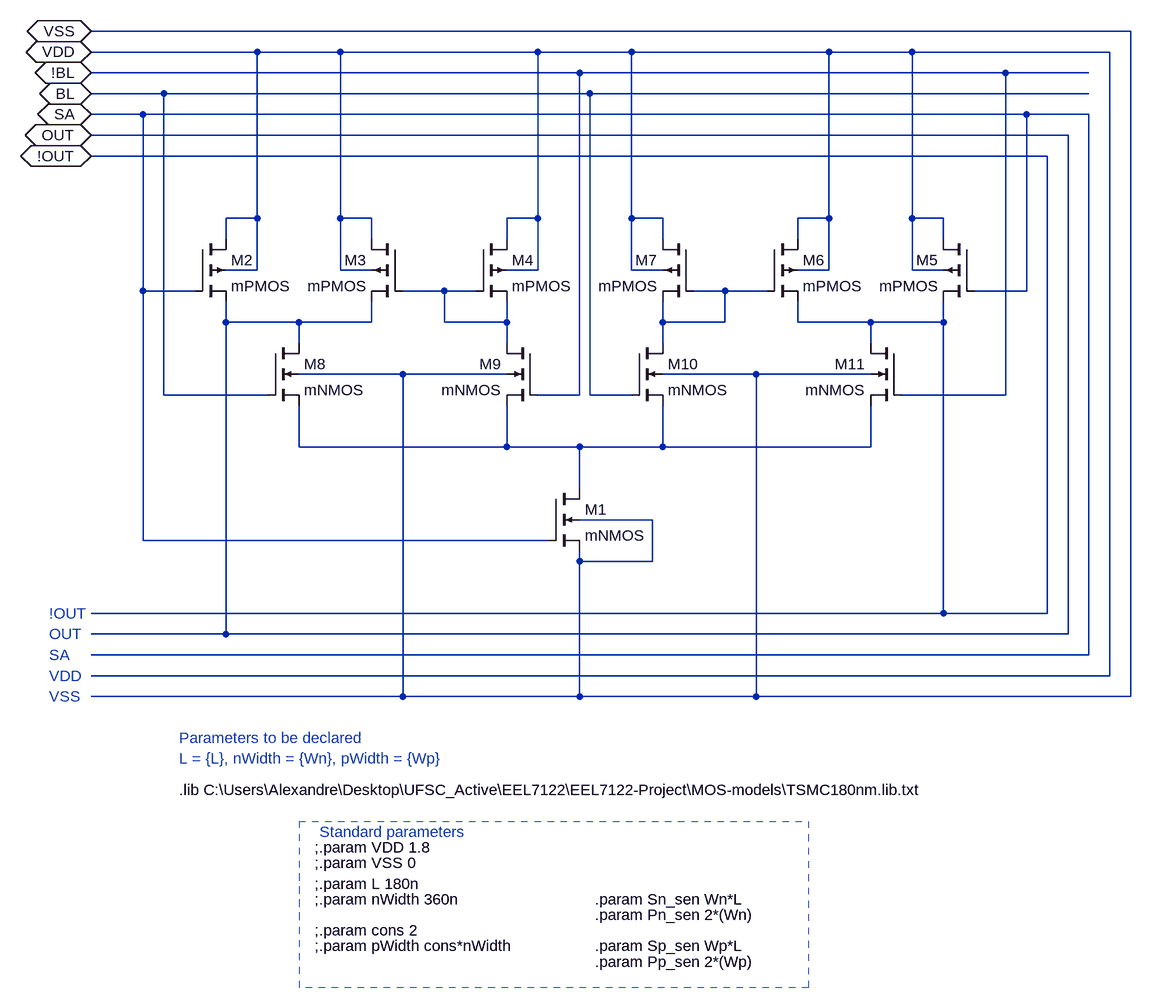
[diagram p0: schematic SEN_AMP_2.asc]
SEN_AMP_2.asc, the LTspice schematic file:
Version 4
SHEET 1 996 964
WIRE 896 -512 -704 -512
WIRE -448 -480 -704 -480
WIRE -320 -480 -448 -480
WIRE -16 -480 -320 -480
WIRE 128 -480 -16 -480
WIRE 432 -480 128 -480
WIRE 560 -480 432 -480
WIRE 864 -480 560 -480
WIRE 48 -448 -704 -448
WIRE 704 -448 48 -448
WIRE 832 -448 704 -448
WIRE -592 -416 -704 -416
WIRE 64 -416 -592 -416
WIRE 832 -416 64 -416
WIRE -624 -384 -704 -384
WIRE 736 -384 -624 -384
WIRE 832 -384 736 -384
WIRE 800 -352 -704 -352
WIRE 768 -320 -704 -320
WIRE -448 -224 -448 -480
WIRE -448 -224 -496 -224
WIRE -320 -224 -320 -480
WIRE -272 -224 -320 -224
WIRE -16 -224 -16 -480
WIRE -16 -224 -64 -224
WIRE 128 -224 128 -480
WIRE 176 -224 128 -224
WIRE 432 -224 432 -480
WIRE 432 -224 384 -224
WIRE 560 -224 560 -480
WIRE 608 -224 560 -224
WIRE -496 -192 -496 -224
WIRE -272 -192 -272 -224
WIRE -64 -192 -64 -224
WIRE 176 -192 176 -224
WIRE 384 -192 384 -224
WIRE 608 -192 608 -224
WIRE -448 -144 -448 -224
WIRE -448 -144 -496 -144
WIRE -320 -144 -320 -224
WIRE -272 -144 -320 -144
WIRE -16 -144 -16 -224
WIRE -16 -144 -64 -144
WIRE 128 -144 128 -224
WIRE 176 -144 128 -144
WIRE 432 -144 432 -224
WIRE 432 -144 384 -144
WIRE 560 -144 560 -224
WIRE 608 -144 560 -144
WIRE -624 -112 -624 -384
WIRE -544 -112 -624 -112
WIRE -160 -112 -224 -112
WIRE -112 -112 -160 -112
WIRE 272 -112 224 -112
WIRE 336 -112 272 -112
WIRE 736 -112 736 -384
WIRE 736 -112 656 -112
WIRE -496 -64 -496 -96
WIRE -384 -64 -496 -64
WIRE -272 -64 -272 -96
WIRE -272 -64 -384 -64
WIRE -160 -64 -160 -112
WIRE -64 -64 -64 -96
WIRE -64 -64 -160 -64
WIRE 176 -64 176 -96
WIRE 272 -64 272 -112
WIRE 272 -64 176 -64
WIRE 384 -64 384 -96
WIRE 496 -64 384 -64
WIRE 608 -64 608 -96
WIRE 608 -64 496 -64
WIRE -384 -32 -384 -64
WIRE -64 -32 -64 -64
WIRE 176 -32 176 -64
WIRE 496 -32 496 -64
WIRE -224 16 -384 16
WIRE -64 16 -224 16
WIRE 320 16 176 16
WIRE 496 16 320 16
WIRE -592 48 -592 -416
WIRE -432 48 -592 48
WIRE 48 48 48 -448
WIRE 48 48 -16 48
WIRE 64 48 64 -416
WIRE 128 48 64 48
WIRE 704 48 704 -448
WIRE 704 48 544 48
WIRE -384 128 -384 64
WIRE -64 128 -64 64
WIRE -64 128 -384 128
WIRE 48 128 -64 128
WIRE 176 128 176 64
WIRE 176 128 48 128
WIRE 496 128 496 64
WIRE 496 128 176 128
WIRE 48 192 48 128
WIRE 160 240 48 240
WIRE -624 272 -624 -112
WIRE 0 272 -624 272
WIRE 48 304 48 288
WIRE 160 304 160 240
WIRE 160 304 48 304
WIRE 608 384 608 -64
WIRE 608 384 -704 384
WIRE 768 384 768 -320
WIRE 768 384 608 384
WIRE -496 416 -496 -64
WIRE -496 416 -704 416
WIRE 800 416 800 -352
WIRE 800 416 -496 416
WIRE 832 448 832 -384
WIRE 832 448 -704 448
WIRE 864 480 864 -480
WIRE 864 480 -704 480
WIRE -224 512 -224 16
WIRE -224 512 -704 512
WIRE 48 512 48 304
WIRE 48 512 -224 512
WIRE 320 512 320 16
WIRE 320 512 48 512
WIRE 896 512 896 -512
WIRE 896 512 320 512
FLAG -704 -512 VSS
IOPIN -704 -512 BiDir
FLAG -704 -480 VDD
IOPIN -704 -480 BiDir
FLAG -704 -448 !BL
IOPIN -704 -448 BiDir
FLAG -704 -416 BL
IOPIN -704 -416 BiDir
FLAG -704 -384 SA
IOPIN -704 -384 BiDir
FLAG -704 -352 OUT
IOPIN -704 -352 BiDir
FLAG -704 -320 !OUT
IOPIN -704 -320 BiDir
SYMBOL nmos4 0 192 R0
SYMATTR InstName M1
SYMATTR Value mNMOS
SYMATTR Value2 l={L} w={nWidth} ad={Sn_sen} as={Sn_sen} pd={Pn_sen} ps={Pn_sen} m=1
SYMBOL pmos4 -544 -192 R0
SYMATTR InstName M2
SYMATTR Value mPMOS
SYMATTR Value2 l=180n w={pWidth} ad={Sp_sen} as={Sp_sen} pd={Pp_sen} ps={Pp_sen} m=1
SYMBOL pmos4 -224 -192 M0
SYMATTR InstName M3
SYMATTR Value mPMOS
SYMATTR Value2 l=180n w={pWidth} ad={Sp_sen} as={Sp_sen} pd={Pp_sen} ps={Pp_sen} m=1
SYMBOL pmos4 -112 -192 R0
SYMATTR InstName M4
SYMATTR Value mPMOS
SYMATTR Value2 l=180n w={pWidth} ad={Sp_sen} as={Sp_sen} pd={Pp_sen} ps={Pp_sen} m=1
SYMBOL pmos4 656 -192 M0
SYMATTR InstName M5
SYMATTR Value mPMOS
SYMATTR Value2 l=180n w={pWidth} ad={Sp_sen} as={Sp_sen} pd={Pp_sen} ps={Pp_sen} m=1
SYMBOL pmos4 336 -192 R0
SYMATTR InstName M6
SYMATTR Value mPMOS
SYMATTR Value2 l=180n w={pWidth} ad={Sp_sen} as={Sp_sen} pd={Pp_sen} ps={Pp_sen} m=1
SYMBOL pmos4 224 -192 M0
SYMATTR InstName M7
SYMATTR Value mPMOS
SYMATTR Value2 l=180n w={pWidth} ad={Sp_sen} as={Sp_sen} pd={Pp_sen} ps={Pp_sen} m=1
SYMBOL nmos4 -432 -32 R0
SYMATTR InstName M8
SYMATTR Value mNMOS
SYMATTR Value2 l={L} w={nWidth} ad={Sn_sen} as={Sn_sen} pd={Pn_sen} ps={Pn_sen} m=1
SYMBOL nmos4 -16 -32 M0
SYMATTR InstName M9
SYMATTR Value mNMOS
SYMATTR Value2 l={L} w={nWidth} ad={Sn_sen} as={Sn_sen} pd={Pn_sen} ps={Pn_sen} m=1
SYMBOL nmos4 128 -32 R0
SYMATTR InstName M10
SYMATTR Value mNMOS
SYMATTR Value2 l={L} w={nWidth} ad={Sn_sen} as={Sn_sen} pd={Pn_sen} ps={Pn_sen} m=1
SYMBOL nmos4 544 -32 M0
SYMATTR InstName M11
SYMATTR Value mNMOS
SYMATTR Value2 l={L} w={nWidth} ad={Sn_sen} as={Sn_sen} pd={Pn_sen} ps={Pn_sen} m=1
TEXT -568 656 Left 2 !.lib C:\\Users\\Alexandre\\Desktop\\UFSC_Active\\EEL7122\\EEL7122-Project\\MOS-models\\TSMC180nm.lib.txt
TEXT -352 720 Left 2 ;Standard parameters
TEXT -360 744 Left 2 !;.param VDD 1.8
TEXT -360 768 Left 2 !;.param VSS 0
TEXT -360 824 Left 2 !;.param nWidth 360n
TEXT -360 896 Left 2 !;.param pWidth cons*nWidth
TEXT 72 896 Left 2 !.param Sp_sen Wp*L
TEXT 72 920 Left 2 !.param Pp_sen 2*(Wp)
TEXT 72 824 Left 2 !.param Sn_sen Wn*L
TEXT 72 848 Left 2 !.param Pn_sen 2*(Wn)
TEXT -360 872 Left 2 !;.param cons 2
TEXT -360 800 Left 2 !;.param L 180n
TEXT -568 576 Left 2 ;Parameters to be declared\nL = {L}, nWidth = {Wn}, pWidth = {Wp}
TEXT -768 416 Left 2 ;OUT
TEXT -768 384 Left 2 ;!OUT
TEXT -768 448 Left 2 ;SA
TEXT -768 480 Left 2 ;VDD
TEXT -768 512 Left 2 ;VSS
LINE Normal -384 704 240 704 2
LINE Normal -384 704 -384 928 2
LINE Normal -384 928 -384 960 2
LINE Normal -384 784 -384 864 2
LINE Normal 400 960 -384 960 2
LINE Normal 400 704 400 960 2
LINE Normal 240 704 400 704 2

The netlist it stands for:
* SEN_AMP_2.asc
M1 N003 SA VSS VSS mNMOS l={L} w={nWidth} ad={Sn_sen} as={Sn_sen} pd={Pn_sen} ps={Pn_sen} m=1
M2 VDD SA OUT VDD mPMOS l=180n w={pWidth} ad={Sp_sen} as={Sp_sen} pd={Pp_sen} ps={Pp_sen} m=1
M3 VDD N001 OUT VDD mPMOS l=180n w={pWidth} ad={Sp_sen} as={Sp_sen} pd={Pp_sen} ps={Pp_sen} m=1
M4 VDD N001 N001 VDD mPMOS l=180n w={pWidth} ad={Sp_sen} as={Sp_sen} pd={Pp_sen} ps={Pp_sen} m=1
M5 VDD SA !OUT VDD mPMOS l=180n w={pWidth} ad={Sp_sen} as={Sp_sen} pd={Pp_sen} ps={Pp_sen} m=1
M6 VDD N002 !OUT VDD mPMOS l=180n w={pWidth} ad={Sp_sen} as={Sp_sen} pd={Pp_sen} ps={Pp_sen} m=1
M7 VDD N002 N002 VDD mPMOS l=180n w={pWidth} ad={Sp_sen} as={Sp_sen} pd={Pp_sen} ps={Pp_sen} m=1
M8 OUT BL N003 VSS mNMOS l={L} w={nWidth} ad={Sn_sen} as={Sn_sen} pd={Pn_sen} ps={Pn_sen} m=1
M9 N001 !BL N003 VSS mNMOS l={L} w={nWidth} ad={Sn_sen} as={Sn_sen} pd={Pn_sen} ps={Pn_sen} m=1
M10 N002 BL N003 VSS mNMOS l={L} w={nWidth} ad={Sn_sen} as={Sn_sen} pd={Pn_sen} ps={Pn_sen} m=1
M11 !OUT !BL N003 VSS mNMOS l={L} w={nWidth} ad={Sn_sen} as={Sn_sen} pd={Pn_sen} ps={Pn_sen} m=1
.model NMOS NMOS
.model PMOS PMOS
.lib standard.mos
.lib C:\Users\Alexandre\Desktop\UFSC_Active\EEL7122\EEL7122-Project\MOS-models\TSMC180nm.lib.txt
* Standard parameters
;.param VDD 1.8
;.param VSS 0
;.param nWidth 360n
;.param pWidth cons*nWidth
.param Sp_sen Wp*L
.param Pp_sen 2*(Wp)
.param Sn_sen Wn*L
.param Pn_sen 2*(Wn)
;.param cons 2
;.param L 180n
* Parameters to be declared
* L = {L}, nWidth = {Wn}, pWidth = {Wp}
* OUT
* !OUT
* SA
* VDD
* VSS
.backanno
.end